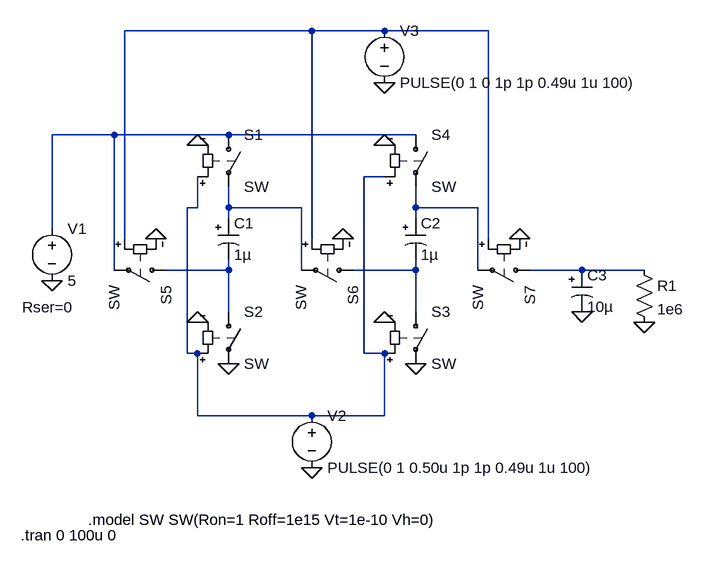
[diagram p0: schematic SP.asc]
SP.asc, the LTspice schematic file:
Version 4
SHEET 1 960 680
WIRE 272 -192 -16 -192
WIRE 384 -192 272 -192
WIRE 544 -192 384 -192
WIRE -32 -32 -128 -32
WIRE 144 -32 -32 -32
WIRE 432 -32 144 -32
WIRE 384 32 352 32
WIRE 96 80 96 32
WIRE 96 80 80 80
WIRE 144 80 144 48
WIRE 256 80 144 80
WIRE 432 80 432 48
WIRE 528 80 432 80
WIRE 144 96 144 80
WIRE 432 96 432 80
WIRE -128 112 -128 -32
WIRE -16 128 -16 -192
WIRE 272 128 272 -192
WIRE 544 128 544 -192
WIRE -32 176 -32 -32
WIRE 144 176 144 160
WIRE 144 176 48 176
WIRE 256 176 256 80
WIRE 432 176 432 160
WIRE 432 176 336 176
WIRE 528 176 528 80
WIRE 688 176 608 176
WIRE 784 176 688 176
WIRE 144 240 144 176
WIRE 432 240 432 176
WIRE 80 304 80 80
WIRE 96 304 80 304
WIRE 352 304 352 32
WIRE 384 304 352 304
WIRE 96 400 96 304
WIRE 272 400 96 400
WIRE 384 400 384 304
WIRE 384 400 272 400
FLAG -128 192 0
FLAG 144 320 0
FLAG 432 320 0
FLAG 784 256 0
FLAG 32 128 0
FLAG 96 -16 0
FLAG 320 128 0
FLAG 384 -16 0
FLAG 96 256 0
FLAG 384 256 0
FLAG 592 128 0
FLAG 384 -112 0
FLAG 272 480 0
FLAG 688 240 0
SYMBOL voltage -128 96 R0
WINDOW 123 0 0 Left 2
WINDOW 39 -46 137 Left 2
SYMATTR SpiceLine Rser=0
SYMATTR InstName V1
SYMATTR Value 5
SYMBOL polcap 128 96 R0
SYMATTR InstName C1
SYMATTR Value 1µ
SYMATTR SpiceLine Rser=0
SYMBOL polcap 416 96 R0
SYMATTR InstName C2
SYMATTR Value 1µ
SYMATTR SpiceLine Rser=0
SYMBOL res 768 160 R0
SYMATTR InstName R1
SYMATTR Value 1e6
SYMBOL sw 144 -48 R0
SYMATTR InstName S1
SYMBOL sw 144 224 R0
SYMATTR InstName S2
SYMBOL sw 432 224 R0
SYMATTR InstName S3
SYMBOL sw 432 -48 R0
SYMATTR InstName S4
SYMBOL sw 64 176 R90
SYMATTR InstName S5
SYMBOL sw 352 176 R90
SYMATTR InstName S6
SYMBOL sw 624 176 R90
SYMATTR InstName S7
SYMBOL voltage 272 384 R0
WINDOW 123 0 0 Left 2
WINDOW 39 0 0 Left 2
SYMATTR InstName V2
SYMATTR Value PULSE(0 1 0.50u 1p 1p 0.49u 1u 100)
SYMBOL voltage 384 -208 R0
WINDOW 123 0 0 Left 2
WINDOW 39 0 0 Left 2
SYMATTR InstName V3
SYMATTR Value PULSE(0 1 0 1p 1p 0.49u 1u 100)
SYMBOL polcap 672 176 R0
SYMATTR InstName C3
SYMATTR Value 10µ
SYMATTR SpiceLine Rser=0
TEXT -72 560 Left 2 !.model SW SW(Ron=1 Roff=1e15 Vt=1e-10 Vh=0)
TEXT -176 584 Left 2 !.tran 0 100u 0

The netlist it stands for:
* SP.asc
V1 N002 0 5 Rser=0
C1 N004 N006 1µ Rser=0
C2 N005 N007 1µ Rser=0
R1 N008 0 1e6
S1 N002 N004 N003 0 SW
S2 N006 0 N003 0 SW
S3 N007 0 N003 0 SW
S4 N002 N005 N003 0 SW
S5 N006 N002 N001 0 SW
S6 N007 N004 N001 0 SW
S7 N008 N005 N001 0 SW
V2 N003 0 PULSE(0 1 0.50u 1p 1p 0.49u 1u 100)
V3 N001 0 PULSE(0 1 0 1p 1p 0.49u 1u 100)
C3 N008 0 10µ Rser=0
.model SW SW(Ron=1 Roff=1e15 Vt=1e-10 Vh=0)
.tran 0 100u 0
.backanno
.end